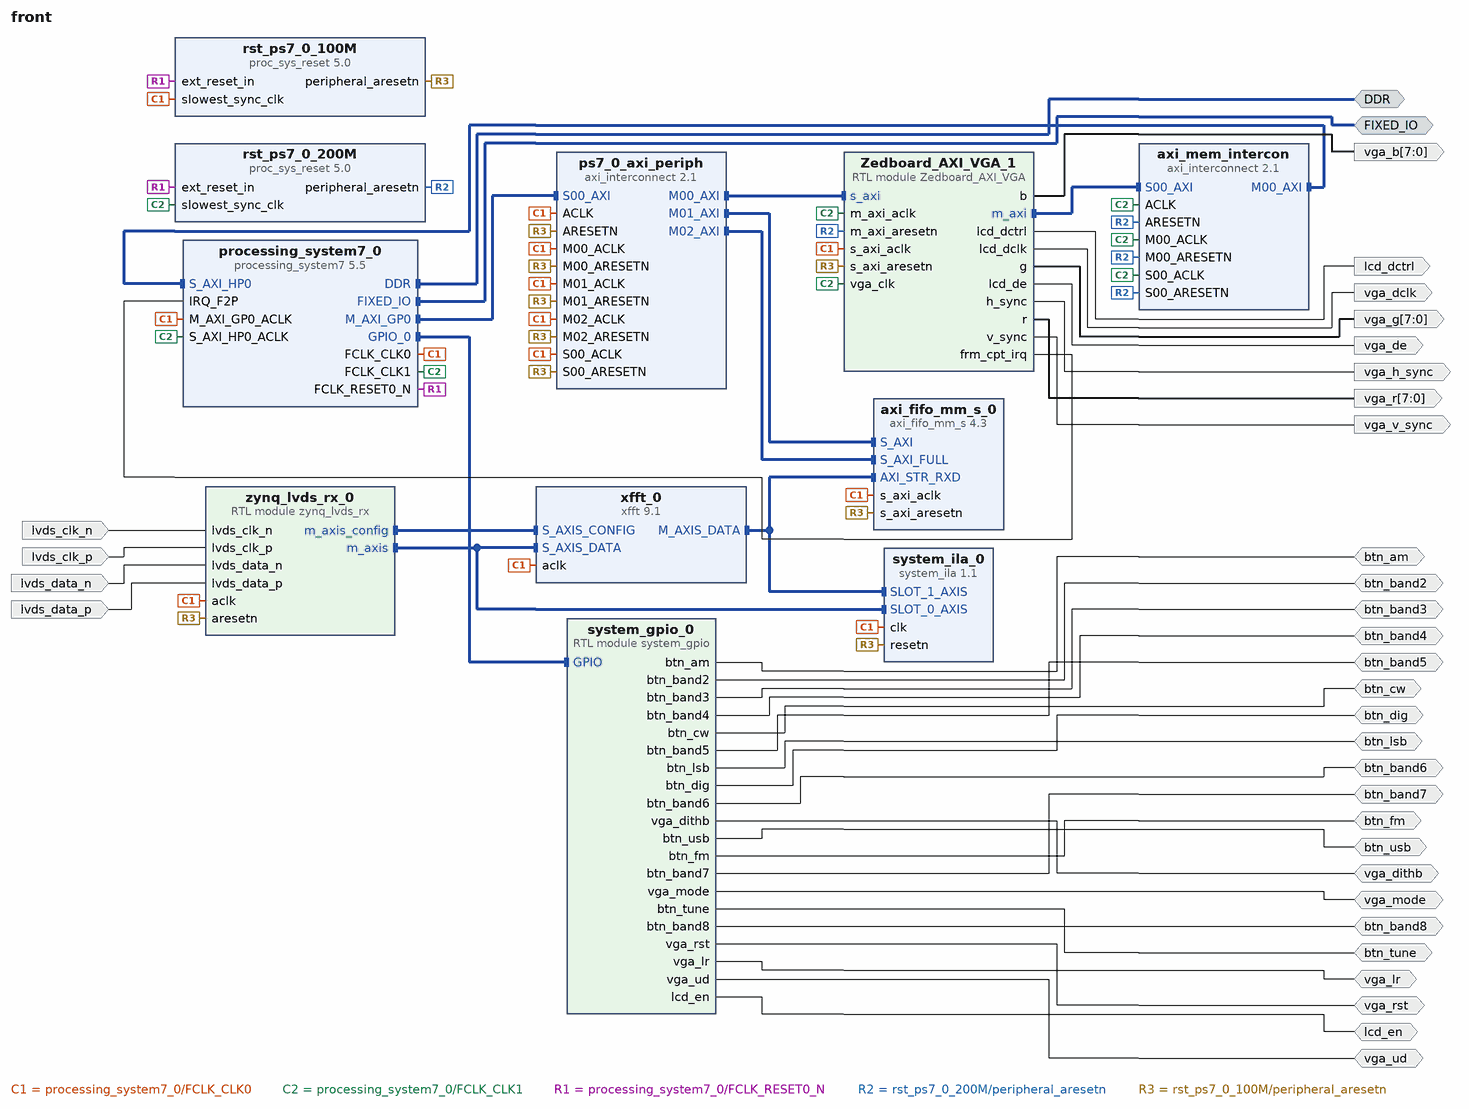
[diagram p0: block diagram of the top level]
# Vivado block design front, xc7z010clg400-1, Vivado 2023.2
create_bd_design front

create_bd_intf_port -mode Master -vlnv xilinx.com:interface:ddrx_rtl:1.0 DDR
create_bd_intf_port -mode Master -vlnv xilinx.com:display_processing_system7:fixedio_rtl:1.0 FIXED_IO
create_bd_port -dir O vga_h_sync
create_bd_port -dir O vga_v_sync
create_bd_port -dir O -from 7 -to 0 vga_r
create_bd_port -dir O -from 7 -to 0 vga_g
create_bd_port -dir O -from 7 -to 0 vga_b
create_bd_port -dir O vga_dclk
create_bd_port -dir IO vga_mode
create_bd_port -dir IO vga_ud
create_bd_port -dir IO vga_dithb
create_bd_port -dir IO vga_lr
create_bd_port -dir IO -type rst vga_rst
set_property -dict {CONFIG.POLARITY ACTIVE_HIGH} [get_bd_ports vga_rst]
create_bd_port -dir IO btn_lsb
create_bd_port -dir IO btn_usb
create_bd_port -dir IO btn_am
create_bd_port -dir IO btn_fm
create_bd_port -dir IO btn_dig
create_bd_port -dir IO btn_cw
create_bd_port -dir IO btn_tune
create_bd_port -dir IO btn_band2
create_bd_port -dir IO btn_band3
create_bd_port -dir IO btn_band4
create_bd_port -dir IO btn_band5
create_bd_port -dir IO btn_band6
create_bd_port -dir IO btn_band7
create_bd_port -dir IO btn_band8
create_bd_port -dir IO lcd_en
create_bd_port -dir O vga_de
create_bd_port -dir O lcd_dctrl
create_bd_port -dir I -type clk lvds_clk_p
set_property -dict {CONFIG.FREQ_HZ 100000000} [get_bd_ports lvds_clk_p]
create_bd_port -dir I -type clk lvds_clk_n
set_property -dict {CONFIG.FREQ_HZ 100000000} [get_bd_ports lvds_clk_n]
create_bd_port -dir I lvds_data_p
create_bd_port -dir I lvds_data_n

create_bd_cell -type ip -vlnv xilinx.com:ip:processing_system7:5.5 processing_system7_0
set_property -dict [list \
  CONFIG.PCW_APU_PERIPHERAL_FREQMHZ 666.666666 \
  CONFIG.PCW_ENET0_PERIPHERAL_ENABLE 0 \
  CONFIG.PCW_EN_CLK1_PORT 1 \
  CONFIG.PCW_FPGA0_PERIPHERAL_FREQMHZ 100 \
  CONFIG.PCW_FPGA1_PERIPHERAL_FREQMHZ 200 \
  CONFIG.PCW_FPGA2_PERIPHERAL_FREQMHZ 200 \
  CONFIG.PCW_FPGA_FCLK1_ENABLE 1 \
  CONFIG.PCW_GPIO_EMIO_GPIO_ENABLE 1 \
  CONFIG.PCW_GPIO_EMIO_GPIO_IO 20 \
  CONFIG.PCW_GPIO_EMIO_GPIO_WIDTH 20 \
  CONFIG.PCW_GPIO_MIO_GPIO_ENABLE 0 \
  CONFIG.PCW_I2C0_GRP_INT_ENABLE 1 \
  CONFIG.PCW_I2C0_GRP_INT_IO EMIO \
  CONFIG.PCW_I2C0_I2C0_IO {MIO 18 .. 19} \
  CONFIG.PCW_I2C0_PERIPHERAL_ENABLE 1 \
  CONFIG.PCW_I2C_PERIPHERAL_FREQMHZ 111.111115 \
  CONFIG.PCW_IRQ_F2P_INTR 1 \
  CONFIG.PCW_PERIPHERAL_BOARD_PRESET None \
  CONFIG.PCW_PRESET_BANK1_VOLTAGE {LVCMOS 3.3V} \
  CONFIG.PCW_QSPI_PERIPHERAL_ENABLE 0 \
  CONFIG.PCW_SD0_PERIPHERAL_ENABLE 0 \
  CONFIG.PCW_UART0_PERIPHERAL_ENABLE 1 \
  CONFIG.PCW_UART0_UART0_IO {MIO 22 .. 23} \
  CONFIG.PCW_UART1_PERIPHERAL_ENABLE 1 \
  CONFIG.PCW_UART1_UART1_IO {MIO 24 .. 25} \
  CONFIG.PCW_UART_PERIPHERAL_FREQMHZ 100 \
  CONFIG.PCW_UIPARAM_DDR_BUS_WIDTH {16 Bit} \
  CONFIG.PCW_UIPARAM_DDR_FREQ_MHZ 533.333333 \
  CONFIG.PCW_UIPARAM_DDR_MEMORY_TYPE {DDR 3 (Low Voltage)} \
  CONFIG.PCW_UIPARAM_DDR_PARTNO {MT41K256M16 RE-125} \
  CONFIG.PCW_USB0_PERIPHERAL_ENABLE 0 \
  CONFIG.PCW_USE_FABRIC_INTERRUPT 1 \
  CONFIG.PCW_USE_S_AXI_HP0 1 \
  CONFIG.preset None \
] [get_bd_cells processing_system7_0]
# 360 more settings of processing_system7_0 are not shown: defaults, MIO pin electricals, DDR timing, and values the tool derives
create_bd_cell -type ip -vlnv xilinx.com:ip:proc_sys_reset:5.0 rst_ps7_0_100M
create_bd_cell -type ip -vlnv xilinx.com:ip:axi_interconnect:2.1 axi_mem_intercon
set_property -dict {CONFIG.NUM_MI 1} [get_bd_cells axi_mem_intercon]
create_bd_cell -type ip -vlnv xilinx.com:ip:proc_sys_reset:5.0 rst_ps7_0_200M
create_bd_cell -type ip -vlnv xilinx.com:ip:axi_interconnect:2.1 ps7_0_axi_periph
set_property -dict {CONFIG.NUM_MI 3} [get_bd_cells ps7_0_axi_periph]
create_bd_cell -type module -reference system_gpio system_gpio_0
create_bd_cell -type module -reference Zedboard_AXI_VGA Zedboard_AXI_VGA_1
create_bd_cell -type module -reference zynq_lvds_rx zynq_lvds_rx_0
create_bd_cell -type ip -vlnv xilinx.com:ip:system_ila:1.1 system_ila_0
set_property -dict [list \
  CONFIG.C_ADV_TRIGGER true \
  CONFIG.C_DATA_DEPTH 2048 \
  CONFIG.C_EN_STRG_QUAL 1 \
  CONFIG.C_MON_TYPE INTERFACE \
  CONFIG.C_NUM_MONITOR_SLOTS 2 \
  CONFIG.C_SLOT_0_APC_EN 0 \
  CONFIG.C_SLOT_0_AXI_DATA_SEL 1 \
  CONFIG.C_SLOT_0_AXI_TRIG_SEL 1 \
  CONFIG.C_SLOT_0_INTF_TYPE xilinx.com:interface:axis_rtl:1.0 \
  CONFIG.C_SLOT_1_APC_EN 0 \
  CONFIG.C_SLOT_1_AXI_DATA_SEL 1 \
  CONFIG.C_SLOT_1_AXI_TRIG_SEL 1 \
  CONFIG.C_SLOT_1_INTF_TYPE xilinx.com:interface:axis_rtl:1.0 \
] [get_bd_cells system_ila_0]
create_bd_cell -type ip -vlnv xilinx.com:ip:xfft:9.1 xfft_0
set_property -dict [list \
  CONFIG.implementation_options automatically_select \
  CONFIG.number_of_stages_using_block_ram_for_data_and_phase_factors 0 \
  CONFIG.target_clock_frequency 100 \
  CONFIG.target_data_throughput 1 \
  CONFIG.transform_length 2048 \
] [get_bd_cells xfft_0]
create_bd_cell -type ip -vlnv xilinx.com:ip:axi_fifo_mm_s:4.3 axi_fifo_mm_s_0
set_property -dict [list \
  CONFIG.C_DATA_INTERFACE_TYPE 1 \
  CONFIG.C_RX_FIFO_DEPTH 4096 \
  CONFIG.C_RX_FIFO_PE_THRESHOLD 5 \
  CONFIG.C_RX_FIFO_PF_THRESHOLD 2049 \
  CONFIG.C_USE_TX_CTRL 0 \
  CONFIG.C_USE_TX_DATA 0 \
] [get_bd_cells axi_fifo_mm_s_0]

# ---- connections ----

connect_bd_intf_net [get_bd_intf_pins Zedboard_AXI_VGA_1/m_axi] [get_bd_intf_pins axi_mem_intercon/S00_AXI]
connect_bd_intf_net [get_bd_intf_pins axi_mem_intercon/M00_AXI] [get_bd_intf_pins processing_system7_0/S_AXI_HP0]
connect_bd_intf_net [get_bd_intf_ports DDR] [get_bd_intf_pins processing_system7_0/DDR]
connect_bd_intf_net [get_bd_intf_ports FIXED_IO] [get_bd_intf_pins processing_system7_0/FIXED_IO]
connect_bd_intf_net [get_bd_intf_pins processing_system7_0/GPIO_0] [get_bd_intf_pins system_gpio_0/GPIO]
connect_bd_intf_net [get_bd_intf_pins processing_system7_0/M_AXI_GP0] [get_bd_intf_pins ps7_0_axi_periph/S00_AXI]
connect_bd_intf_net [get_bd_intf_pins ps7_0_axi_periph/M00_AXI] [get_bd_intf_pins Zedboard_AXI_VGA_1/s_axi]
connect_bd_intf_net [get_bd_intf_pins ps7_0_axi_periph/M01_AXI] [get_bd_intf_pins axi_fifo_mm_s_0/S_AXI]
connect_bd_intf_net [get_bd_intf_pins ps7_0_axi_periph/M02_AXI] [get_bd_intf_pins axi_fifo_mm_s_0/S_AXI_FULL]
connect_bd_intf_net [get_bd_intf_pins xfft_0/M_AXIS_DATA] [get_bd_intf_pins axi_fifo_mm_s_0/AXI_STR_RXD]
connect_bd_intf_net [get_bd_intf_pins xfft_0/M_AXIS_DATA] [get_bd_intf_pins system_ila_0/SLOT_1_AXIS]
connect_bd_intf_net -intf_net zynq_lvds_rx_0_m_axis [get_bd_intf_pins zynq_lvds_rx_0/m_axis] [get_bd_intf_pins xfft_0/S_AXIS_DATA]
connect_bd_intf_net [get_bd_intf_pins zynq_lvds_rx_0/m_axis] [get_bd_intf_pins system_ila_0/SLOT_0_AXIS]
connect_bd_intf_net [get_bd_intf_pins xfft_0/S_AXIS_CONFIG] [get_bd_intf_pins zynq_lvds_rx_0/m_axis_config]
connect_bd_net [get_bd_ports vga_mode] [get_bd_pins system_gpio_0/vga_mode]
connect_bd_net [get_bd_ports vga_ud] [get_bd_pins system_gpio_0/vga_ud]
connect_bd_net [get_bd_ports vga_dithb] [get_bd_pins system_gpio_0/vga_dithb]
connect_bd_net [get_bd_ports vga_rst] [get_bd_pins system_gpio_0/vga_rst]
connect_bd_net [get_bd_ports vga_lr] [get_bd_pins system_gpio_0/vga_lr]
connect_bd_net [get_bd_ports btn_lsb] [get_bd_pins system_gpio_0/btn_lsb]
connect_bd_net [get_bd_ports btn_usb] [get_bd_pins system_gpio_0/btn_usb]
connect_bd_net [get_bd_ports btn_am] [get_bd_pins system_gpio_0/btn_am]
connect_bd_net [get_bd_ports btn_fm] [get_bd_pins system_gpio_0/btn_fm]
connect_bd_net [get_bd_ports btn_dig] [get_bd_pins system_gpio_0/btn_dig]
connect_bd_net [get_bd_ports btn_cw] [get_bd_pins system_gpio_0/btn_cw]
connect_bd_net [get_bd_ports btn_tune] [get_bd_pins system_gpio_0/btn_tune]
connect_bd_net [get_bd_ports btn_band2] [get_bd_pins system_gpio_0/btn_band2]
connect_bd_net [get_bd_ports btn_band3] [get_bd_pins system_gpio_0/btn_band3]
connect_bd_net [get_bd_ports btn_band4] [get_bd_pins system_gpio_0/btn_band4]
connect_bd_net [get_bd_ports btn_band5] [get_bd_pins system_gpio_0/btn_band5]
connect_bd_net [get_bd_ports btn_band6] [get_bd_pins system_gpio_0/btn_band6]
connect_bd_net [get_bd_ports btn_band7] [get_bd_pins system_gpio_0/btn_band7]
connect_bd_net [get_bd_ports btn_band8] [get_bd_pins system_gpio_0/btn_band8]
connect_bd_net [get_bd_ports lcd_en] [get_bd_pins system_gpio_0/lcd_en]
connect_bd_net [get_bd_pins Zedboard_AXI_VGA_1/b] [get_bd_ports vga_b]
connect_bd_net [get_bd_pins Zedboard_AXI_VGA_1/frm_cpt_irq] [get_bd_pins processing_system7_0/IRQ_F2P]
connect_bd_net [get_bd_pins Zedboard_AXI_VGA_1/g] [get_bd_ports vga_g]
connect_bd_net [get_bd_pins Zedboard_AXI_VGA_1/h_sync] [get_bd_ports vga_h_sync]
connect_bd_net [get_bd_pins Zedboard_AXI_VGA_1/lcd_dclk] [get_bd_ports vga_dclk]
connect_bd_net [get_bd_pins Zedboard_AXI_VGA_1/lcd_dctrl] [get_bd_ports lcd_dctrl]
connect_bd_net [get_bd_pins Zedboard_AXI_VGA_1/lcd_de] [get_bd_ports vga_de]
connect_bd_net [get_bd_pins Zedboard_AXI_VGA_1/r] [get_bd_ports vga_r]
connect_bd_net [get_bd_pins Zedboard_AXI_VGA_1/v_sync] [get_bd_ports vga_v_sync]
connect_bd_net [get_bd_ports lvds_clk_n] [get_bd_pins zynq_lvds_rx_0/lvds_clk_n]
connect_bd_net [get_bd_ports lvds_clk_p] [get_bd_pins zynq_lvds_rx_0/lvds_clk_p]
connect_bd_net [get_bd_ports lvds_data_n] [get_bd_pins zynq_lvds_rx_0/lvds_data_n]
connect_bd_net [get_bd_ports lvds_data_p] [get_bd_pins zynq_lvds_rx_0/lvds_data_p]
connect_bd_net [get_bd_pins processing_system7_0/FCLK_CLK0] \
  [get_bd_pins processing_system7_0/M_AXI_GP0_ACLK] [get_bd_pins rst_ps7_0_100M/slowest_sync_clk] \
  [get_bd_pins ps7_0_axi_periph/ACLK] [get_bd_pins ps7_0_axi_periph/S00_ACLK] [get_bd_pins ps7_0_axi_periph/M00_ACLK] \
  [get_bd_pins system_ila_0/clk] [get_bd_pins xfft_0/aclk] [get_bd_pins axi_fifo_mm_s_0/s_axi_aclk] \
  [get_bd_pins ps7_0_axi_periph/M01_ACLK] [get_bd_pins ps7_0_axi_periph/M02_ACLK] [get_bd_pins Zedboard_AXI_VGA_1/s_axi_aclk] \
  [get_bd_pins zynq_lvds_rx_0/aclk]
connect_bd_net [get_bd_pins processing_system7_0/FCLK_CLK1] \
  [get_bd_pins processing_system7_0/S_AXI_HP0_ACLK] [get_bd_pins rst_ps7_0_200M/slowest_sync_clk] \
  [get_bd_pins axi_mem_intercon/ACLK] [get_bd_pins axi_mem_intercon/S00_ACLK] [get_bd_pins axi_mem_intercon/M00_ACLK] \
  [get_bd_pins Zedboard_AXI_VGA_1/vga_clk] [get_bd_pins Zedboard_AXI_VGA_1/m_axi_aclk]
connect_bd_net [get_bd_pins processing_system7_0/FCLK_RESET0_N] [get_bd_pins rst_ps7_0_100M/ext_reset_in] [get_bd_pins rst_ps7_0_200M/ext_reset_in]
connect_bd_net [get_bd_pins rst_ps7_0_200M/peripheral_aresetn] \
  [get_bd_pins axi_mem_intercon/ARESETN] [get_bd_pins axi_mem_intercon/S00_ARESETN] \
  [get_bd_pins axi_mem_intercon/M00_ARESETN] [get_bd_pins Zedboard_AXI_VGA_1/m_axi_aresetn]
connect_bd_net -net rst_ps7_0_50M_peripheral_aresetn [get_bd_pins rst_ps7_0_100M/peripheral_aresetn] \
  [get_bd_pins ps7_0_axi_periph/ARESETN] [get_bd_pins ps7_0_axi_periph/S00_ARESETN] \
  [get_bd_pins ps7_0_axi_periph/M00_ARESETN] [get_bd_pins system_ila_0/resetn] [get_bd_pins axi_fifo_mm_s_0/s_axi_aresetn] \
  [get_bd_pins ps7_0_axi_periph/M01_ARESETN] [get_bd_pins ps7_0_axi_periph/M02_ARESETN] \
  [get_bd_pins Zedboard_AXI_VGA_1/s_axi_aresetn] [get_bd_pins zynq_lvds_rx_0/aresetn]
set_property HDL_ATTRIBUTE.DEBUG true [get_bd_intf_nets zynq_lvds_rx_0_m_axis]
set_property HDL_ATTRIBUTE.MARK_DEBUG true [get_bd_intf_nets zynq_lvds_rx_0_m_axis]

# ---- address map ----
assign_bd_address -offset 0x40000000 -range 64M -target_address_space [get_bd_addr_spaces processing_system7_0/Data] [get_bd_addr_segs Zedboard_AXI_VGA_1/s_axi/reg0]
assign_bd_address -offset 0x44000000 -range 64K -target_address_space [get_bd_addr_spaces processing_system7_0/Data] [get_bd_addr_segs axi_fifo_mm_s_0/S_AXI/Mem0]
assign_bd_address -offset 0x44010000 -range 64K -target_address_space [get_bd_addr_spaces processing_system7_0/Data] [get_bd_addr_segs axi_fifo_mm_s_0/S_AXI_FULL/Mem1]
assign_bd_address -offset 0x00000000 -range 512M -target_address_space [get_bd_addr_spaces Zedboard_AXI_VGA_1/m_axi] [get_bd_addr_segs processing_system7_0/S_AXI_HP0/HP0_DDR_LOWOCM]

validate_bd_design
save_bd_design
